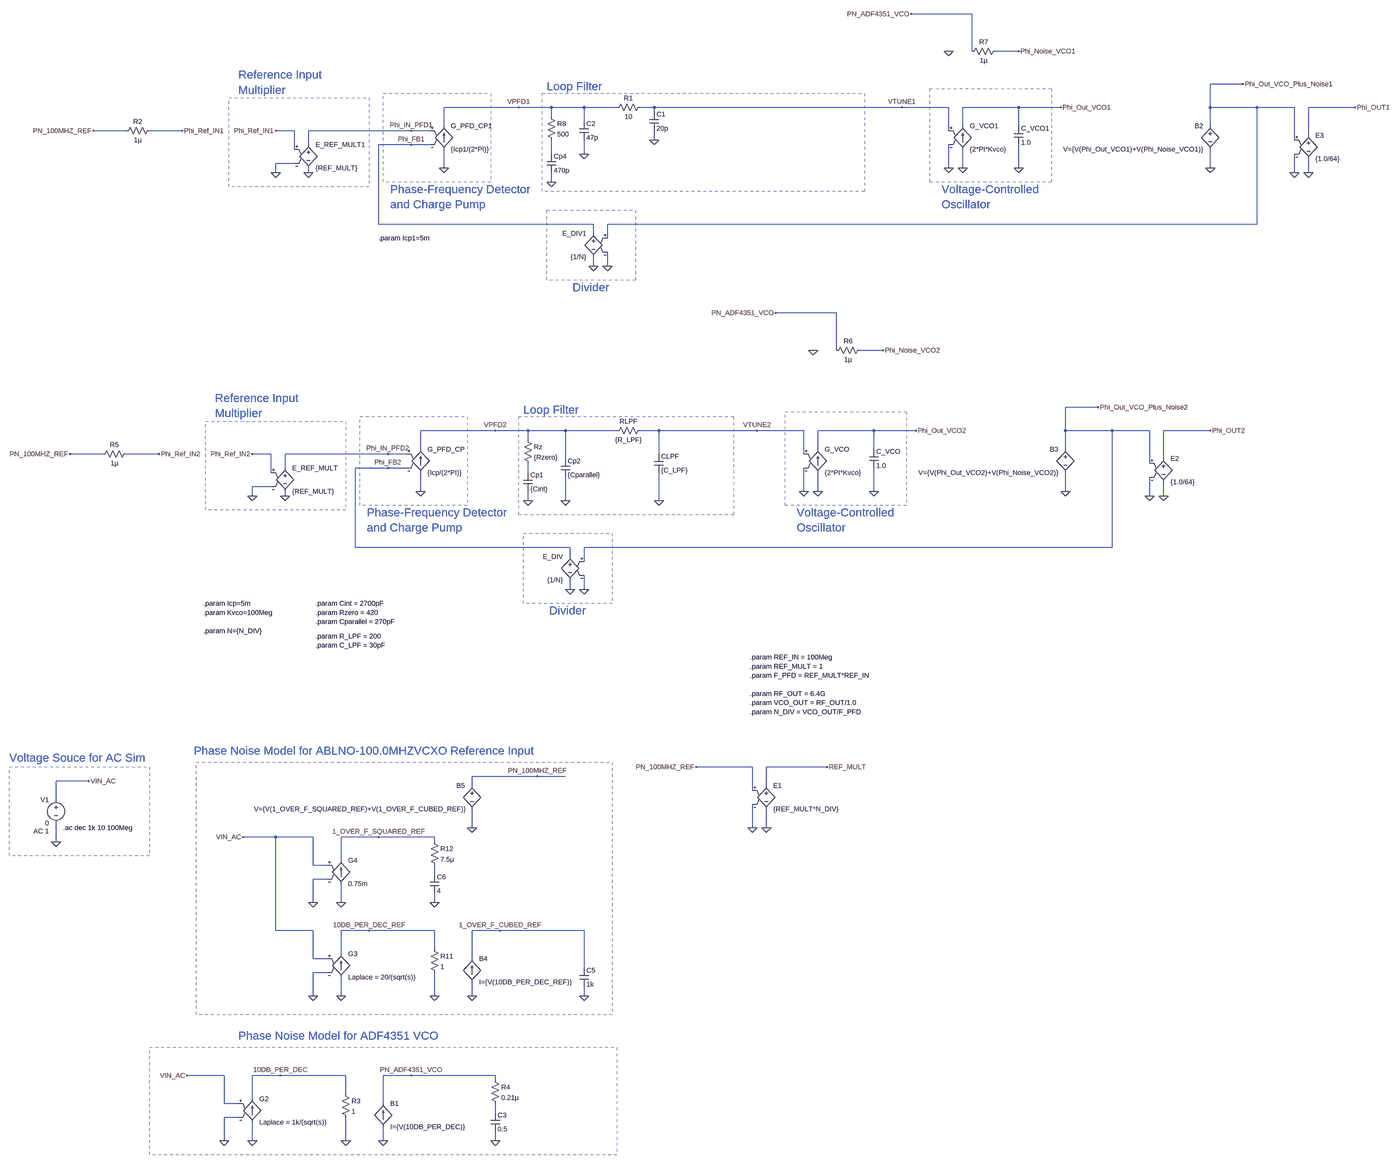
[diagram p0: schematic ADF4355_Freq_Synth_AC_Model.asc, whole sheet]
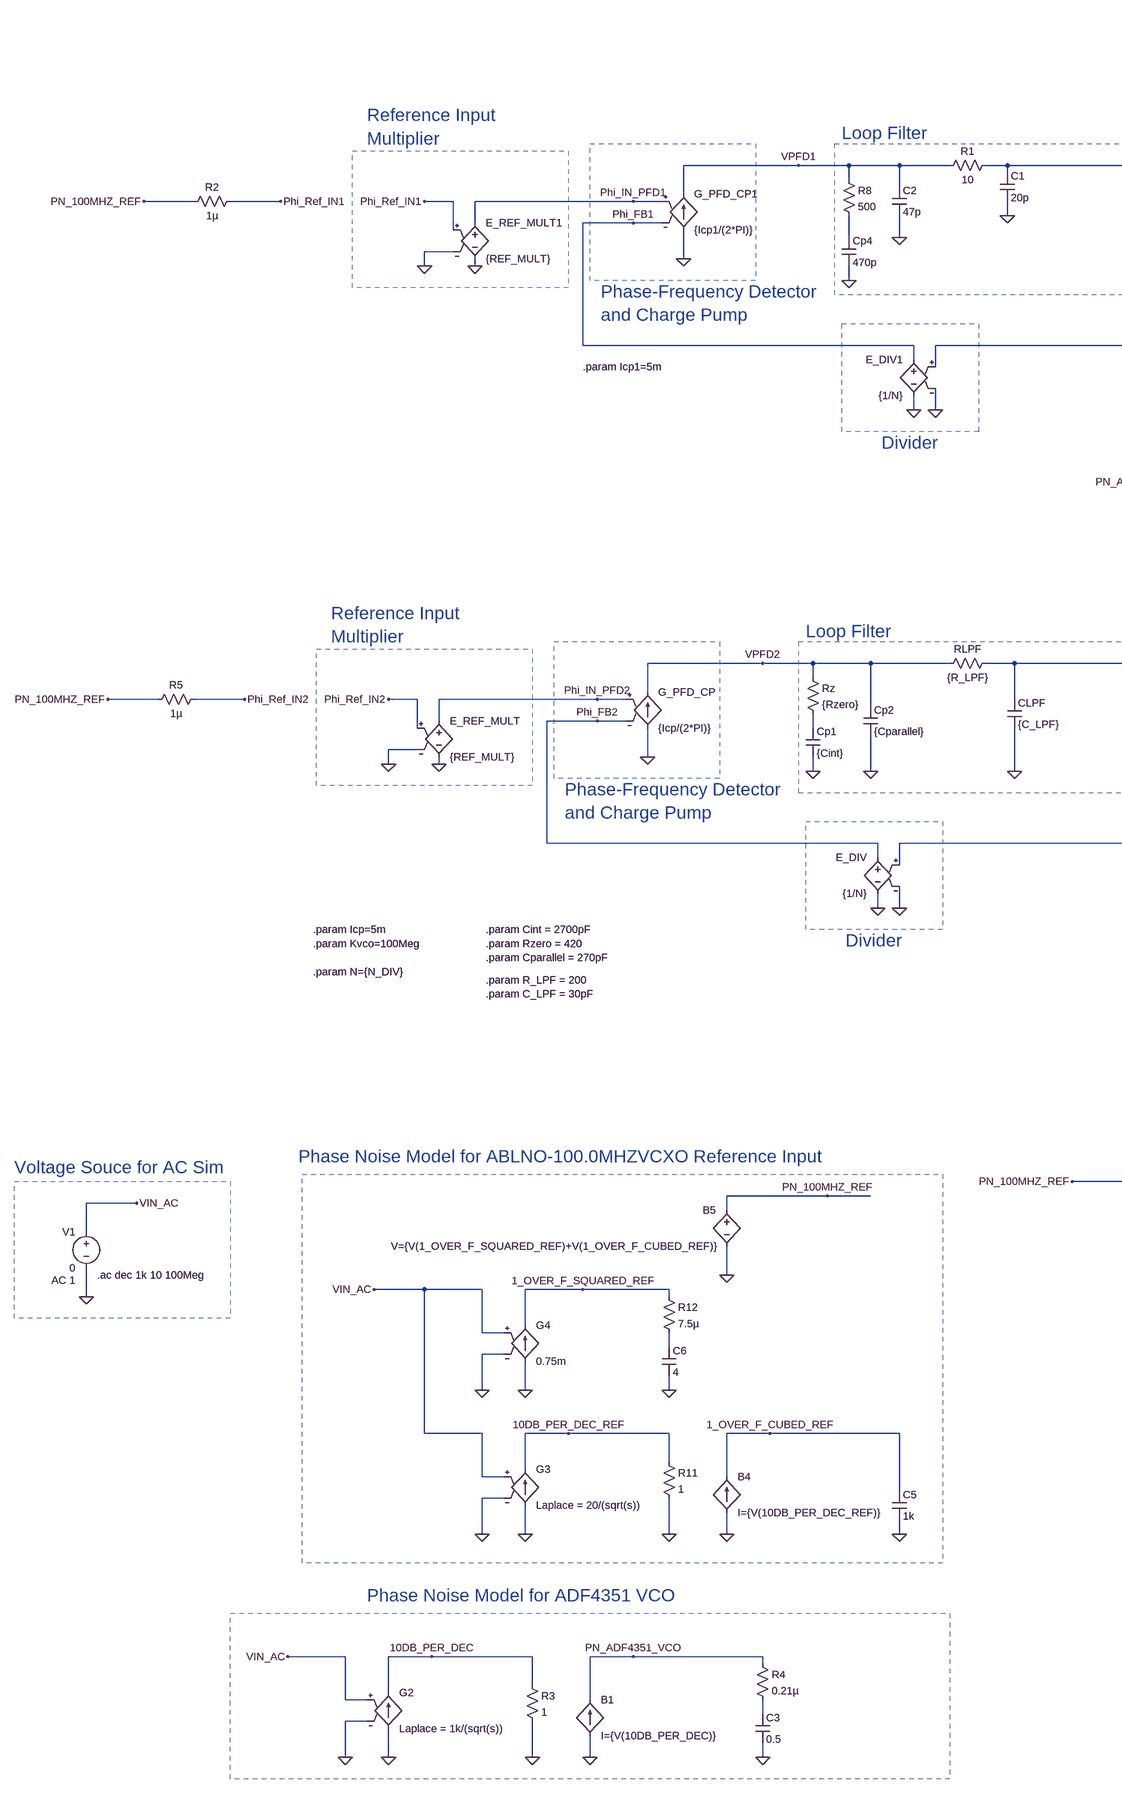
[diagram p1: schematic ADF4355_Freq_Synth_AC_Model.asc, part, row 1 of 1, column 1 of 2]
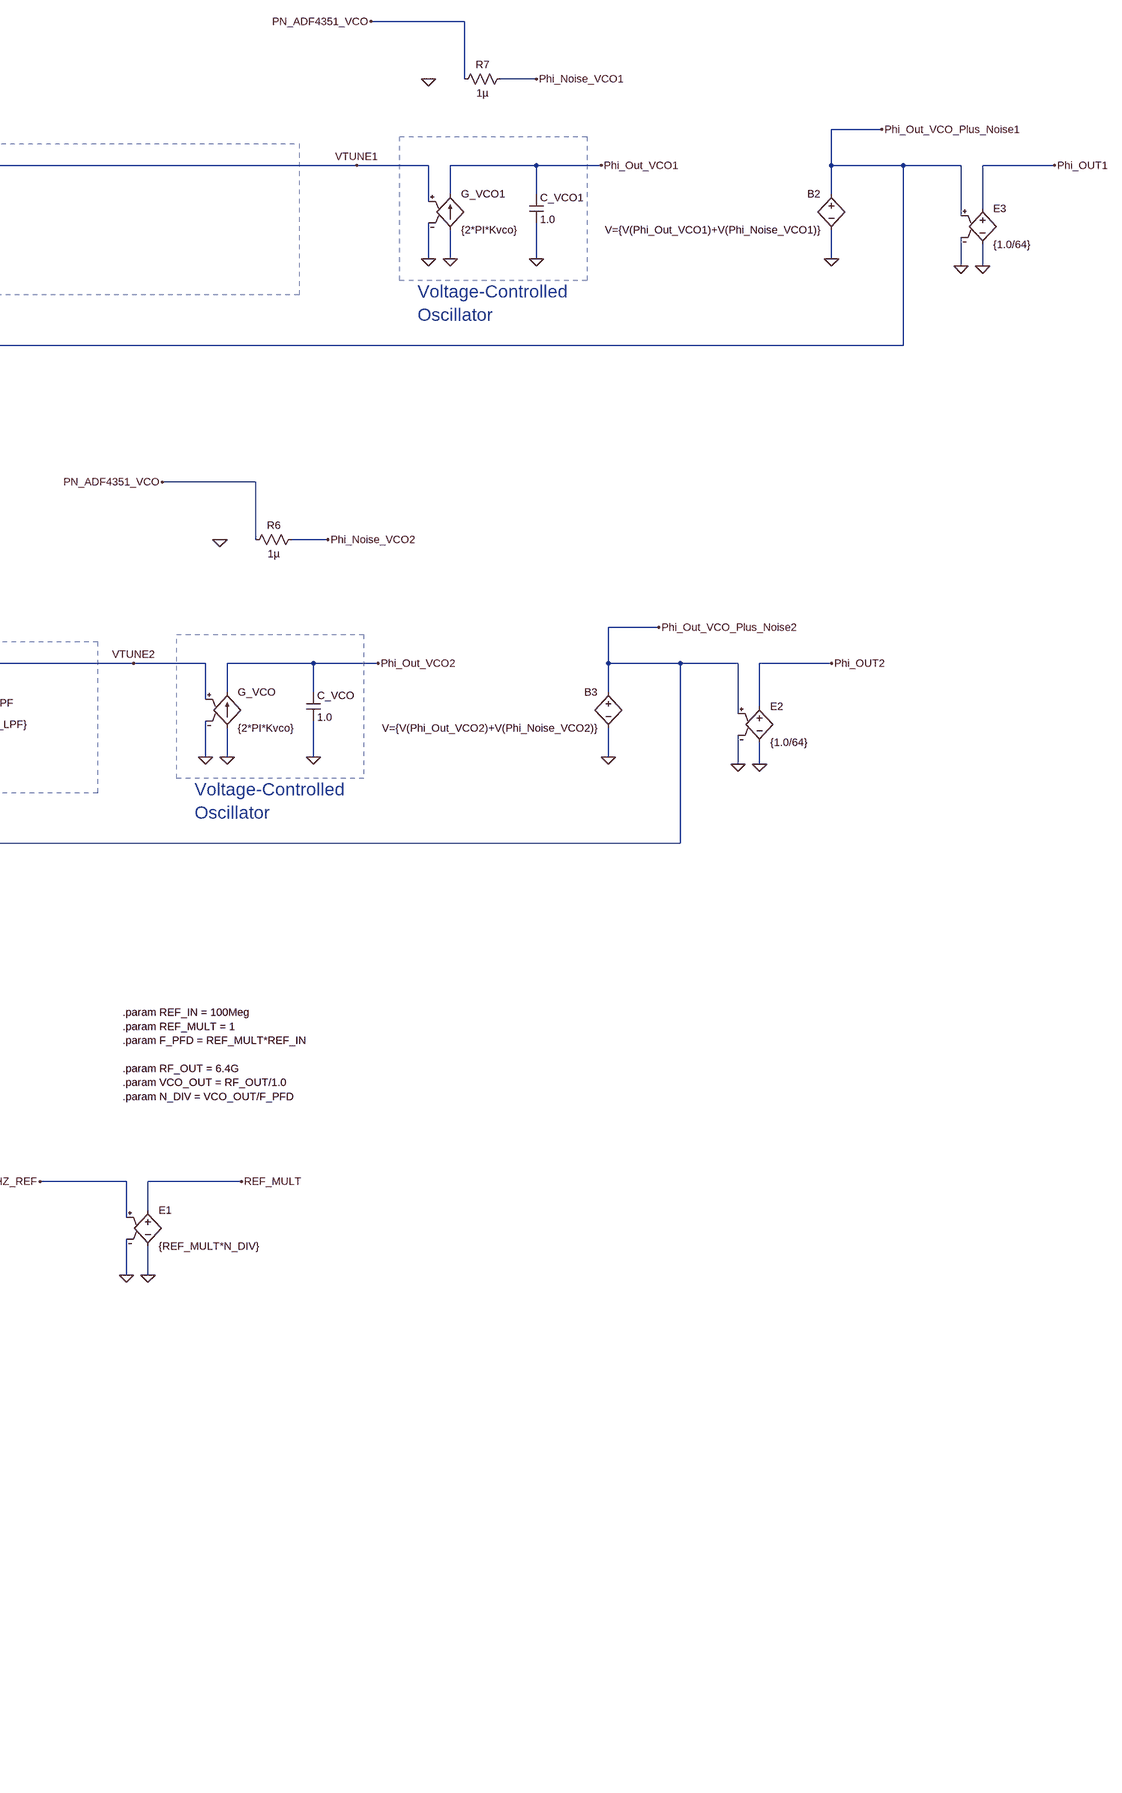
[diagram p2: schematic ADF4355_Freq_Synth_AC_Model.asc, part, row 1 of 1, column 2 of 2]
ADF4355_Freq_Synth_AC_Model.asc, the LTspice schematic file:
Version 4
SHEET 1 1844 2692
WIRE 400 -1344 192 -1344
WIRE 400 -1216 400 -1344
WIRE 560 -1216 480 -1216
WIRE 1328 -1104 1216 -1104
WIRE -1152 -1024 -1408 -1024
WIRE -1040 -1024 -1152 -1024
WIRE -928 -1024 -1040 -1024
WIRE -816 -1024 -928 -1024
WIRE -688 -1024 -736 -1024
WIRE 160 -1024 -688 -1024
WIRE 320 -1024 160 -1024
WIRE 560 -1024 368 -1024
WIRE 704 -1024 560 -1024
WIRE 1216 -1024 1216 -1104
WIRE 1376 -1024 1216 -1024
WIRE 1504 -1024 1376 -1024
WIRE 1712 -1024 1552 -1024
WIRE -688 -1008 -688 -1024
WIRE -1040 -992 -1040 -1024
WIRE -928 -976 -928 -1024
WIRE -1408 -960 -1408 -1024
WIRE 368 -960 368 -1024
WIRE 560 -960 560 -1024
WIRE 1216 -960 1216 -1024
WIRE -2496 -944 -2608 -944
WIRE -2304 -944 -2416 -944
WIRE -1920 -944 -1984 -944
WIRE -1520 -944 -1872 -944
WIRE -1456 -944 -1520 -944
WIRE 320 -944 320 -1024
WIRE 1552 -928 1552 -1024
WIRE -688 -912 -688 -944
WIRE 1504 -912 1504 -1024
WIRE -1872 -896 -1872 -944
WIRE -1520 -896 -1632 -896
WIRE -1456 -896 -1520 -896
WIRE -1920 -880 -1920 -944
WIRE -1040 -864 -1040 -912
WIRE -928 -864 -928 -912
WIRE -1920 -832 -1984 -832
WIRE -1408 -816 -1408 -880
WIRE 320 -816 320 -896
WIRE 368 -816 368 -880
WIRE 560 -816 560 -896
WIRE 1216 -816 1216 -880
WIRE -1984 -800 -1984 -832
WIRE -1872 -800 -1872 -816
WIRE 1504 -800 1504 -864
WIRE 1552 -800 1552 -848
WIRE -1040 -768 -1040 -800
WIRE -1632 -624 -1632 -896
WIRE -896 -624 -1632 -624
WIRE 1376 -624 1376 -1024
WIRE 1376 -624 -848 -624
WIRE -896 -592 -896 -624
WIRE -848 -576 -848 -624
WIRE -896 -480 -896 -512
WIRE -848 -480 -848 -528
WIRE -64 -320 -272 -320
WIRE -64 -192 -64 -320
WIRE 96 -192 16 -192
WIRE 832 48 720 48
WIRE -1232 128 -1488 128
WIRE -1120 128 -1232 128
WIRE -992 128 -1120 128
WIRE -816 128 -992 128
WIRE -672 128 -736 128
WIRE -336 128 -672 128
WIRE -176 128 -336 128
WIRE 64 128 -128 128
WIRE 208 128 64 128
WIRE 720 128 720 48
WIRE 880 128 720 128
WIRE 1008 128 880 128
WIRE 1216 128 1056 128
WIRE -1120 160 -1120 128
WIRE -1488 192 -1488 128
WIRE -128 192 -128 128
WIRE 64 192 64 128
WIRE 720 192 720 128
WIRE -2576 208 -2688 208
WIRE -2384 208 -2496 208
WIRE -2000 208 -2064 208
WIRE -1600 208 -1952 208
WIRE -1536 208 -1600 208
WIRE -672 208 -672 128
WIRE -176 208 -176 128
WIRE -992 224 -992 128
WIRE 1056 224 1056 128
WIRE 1008 240 1008 128
WIRE -1952 256 -1952 208
WIRE -1600 256 -1712 256
WIRE -1536 256 -1600 256
WIRE -2000 272 -2000 208
WIRE -1120 272 -1120 240
WIRE -2000 320 -2064 320
WIRE -1488 336 -1488 272
WIRE -176 336 -176 256
WIRE -128 336 -128 272
WIRE 64 336 64 256
WIRE 720 336 720 272
WIRE -2064 352 -2064 320
WIRE -1952 352 -1952 336
WIRE 1008 352 1008 288
WIRE 1056 352 1056 304
WIRE -1120 368 -1120 336
WIRE -992 368 -992 288
WIRE -672 368 -672 272
WIRE -1712 528 -1712 256
WIRE -976 528 -1712 528
WIRE 880 528 880 128
WIRE 880 528 -928 528
WIRE -976 560 -976 528
WIRE -928 576 -928 528
WIRE -976 672 -976 640
WIRE -928 672 -928 624
WIRE -352 1360 -544 1360
WIRE -96 1360 -304 1360
WIRE -1088 1392 -1312 1392
WIRE -992 1392 -1088 1392
WIRE -2624 1408 -2736 1408
WIRE -1312 1424 -1312 1392
WIRE -304 1424 -304 1360
WIRE -352 1440 -352 1360
WIRE -2736 1472 -2736 1408
WIRE -1312 1568 -1312 1504
WIRE -352 1568 -352 1488
WIRE -304 1568 -304 1504
WIRE -1984 1600 -2096 1600
WIRE -1856 1600 -1984 1600
WIRE -1632 1600 -1760 1600
WIRE -1440 1600 -1632 1600
WIRE -2736 1616 -2736 1552
WIRE -1440 1616 -1440 1600
WIRE -1760 1680 -1760 1600
WIRE -1856 1696 -1856 1600
WIRE -1808 1696 -1856 1696
WIRE -1440 1728 -1440 1696
WIRE -1808 1744 -1856 1744
WIRE -1856 1824 -1856 1744
WIRE -1760 1824 -1760 1760
WIRE -1440 1824 -1440 1792
WIRE -1984 1920 -1984 1600
WIRE -1856 1920 -1984 1920
WIRE -1664 1920 -1760 1920
WIRE -1440 1920 -1664 1920
WIRE -1216 1920 -1312 1920
WIRE -928 1920 -1216 1920
WIRE -1440 1984 -1440 1920
WIRE -1760 2000 -1760 1920
WIRE -1856 2016 -1856 1920
WIRE -1808 2016 -1856 2016
WIRE -1312 2016 -1312 1920
WIRE -928 2048 -928 1920
WIRE -1808 2064 -1856 2064
WIRE -1856 2144 -1856 2064
WIRE -1760 2144 -1760 2080
WIRE -1440 2144 -1440 2064
WIRE -1312 2144 -1312 2096
WIRE -928 2144 -928 2112
WIRE -2160 2416 -2288 2416
WIRE -1968 2416 -2064 2416
WIRE -1744 2416 -1968 2416
WIRE -1520 2416 -1616 2416
WIRE -1232 2416 -1520 2416
WIRE -1232 2432 -1232 2416
WIRE -1744 2480 -1744 2416
WIRE -2064 2496 -2064 2416
WIRE -2160 2512 -2160 2416
WIRE -2112 2512 -2160 2512
WIRE -1616 2512 -1616 2416
WIRE -1232 2544 -1232 2512
WIRE -2112 2560 -2160 2560
WIRE -2160 2640 -2160 2560
WIRE -2064 2640 -2064 2576
WIRE -1744 2640 -1744 2560
WIRE -1616 2640 -1616 2592
WIRE -1232 2640 -1232 2608
FLAG -992 368 0
FLAG -1488 336 0
FLAG 64 336 0
FLAG -128 336 0
FLAG -176 336 0
FLAG 1216 128 Phi_OUT2
FLAG -928 672 0
FLAG -976 672 0
FLAG -1600 256 Phi_FB2
FLAG -1600 208 Phi_IN_PFD2
FLAG -2736 1616 0
FLAG -1120 368 0
FLAG -336 128 VTUNE2
FLAG 208 128 Phi_Out_VCO2
FLAG 96 -192 Phi_Noise_VCO2
FLAG 720 336 0
FLAG -1952 352 0
FLAG -2384 208 Phi_Ref_IN2
FLAG -2064 352 0
FLAG -2064 208 Phi_Ref_IN2
FLAG -672 368 0
FLAG -1232 128 VPFD2
FLAG -2064 2640 0
FLAG -2160 2640 0
FLAG -1744 2640 0
FLAG -2288 2416 VIN_AC
FLAG -1968 2416 10DB_PER_DEC
FLAG -1616 2640 0
FLAG -1232 2640 0
FLAG -1520 2416 PN_ADF4351_VCO
FLAG -2624 1408 VIN_AC
FLAG -272 -320 PN_ADF4351_VCO
FLAG -144 -192 0
FLAG -2688 208 PN_100MHZ_REF
FLAG -304 1568 0
FLAG -352 1568 0
FLAG -96 1360 REF_MULT
FLAG -544 1360 PN_100MHZ_REF
FLAG 1056 352 0
FLAG 1008 352 0
FLAG 832 48 Phi_Out_VCO_Plus_Noise2
FLAG -1408 -816 0
FLAG 560 -816 0
FLAG 368 -816 0
FLAG 320 -816 0
FLAG 1712 -1024 Phi_OUT1
FLAG -848 -480 0
FLAG -896 -480 0
FLAG -1520 -896 Phi_FB1
FLAG -1520 -944 Phi_IN_PFD1
FLAG -1040 -768 0
FLAG 160 -1024 VTUNE1
FLAG 704 -1024 Phi_Out_VCO1
FLAG 1216 -816 0
FLAG -1872 -800 0
FLAG -2304 -944 Phi_Ref_IN1
FLAG -1984 -800 0
FLAG -1984 -944 Phi_Ref_IN1
FLAG -1152 -1024 VPFD1
FLAG -2608 -944 PN_100MHZ_REF
FLAG 1552 -800 0
FLAG 1504 -800 0
FLAG 1328 -1104 Phi_Out_VCO_Plus_Noise1
FLAG 560 -1216 Phi_Noise_VCO1
FLAG 192 -1344 PN_ADF4351_VCO
FLAG 320 -1216 0
FLAG -928 -864 0
FLAG -1760 2144 0
FLAG -1856 2144 0
FLAG -1440 2144 0
FLAG -1664 1920 10DB_PER_DEC_REF
FLAG -1312 2144 0
FLAG -928 2144 0
FLAG -1216 1920 1_OVER_F_CUBED_REF
FLAG -1760 1824 0
FLAG -1856 1824 0
FLAG -1440 1824 0
FLAG -1632 1600 1_OVER_F_SQUARED_REF
FLAG -1312 1568 0
FLAG -2096 1600 VIN_AC
FLAG -1088 1392 PN_100MHZ_REF
FLAG -688 -912 0
DATAFLAG 800 128 ""
DATAFLAG 800 128 ""
DATAFLAG 464 528 ""
DATAFLAG 464 528 ""
DATAFLAG -1808 208 ""
DATAFLAG -1808 208 ""
DATAFLAG -2480 208 ""
SYMBOL g -1488 176 R0
SYMATTR InstName G_PFD_CP
SYMATTR Value {Icp/(2*PI)}
SYMBOL cap -1008 224 R0
SYMATTR InstName Cp2
SYMATTR Value {Cparallel}
SYMBOL cap 48 192 R0
SYMATTR InstName C_VCO
SYMATTR Value 1.0
SYMBOL g -128 176 R0
SYMATTR InstName G_VCO
SYMATTR Value {2*PI*Kvco}
SYMBOL e -976 544 M0
SYMATTR InstName E_DIV
SYMATTR Value {1/N}
SYMBOL voltage -2736 1456 M0
WINDOW 123 24 124 Left 2
WINDOW 39 0 0 Left 2
SYMATTR Value2 AC 1
SYMATTR InstName V1
SYMATTR Value 0
SYMBOL cap -1136 272 R0
SYMATTR InstName Cp1
SYMATTR Value {Cint}
SYMBOL res -1136 144 R0
SYMATTR InstName Rz
SYMATTR Value {Rzero}
SYMBOL bv 720 176 M0
SYMATTR InstName B3
SYMATTR Value V={V(Phi_Out_VCO2)+V(Phi_Noise_VCO2)}
SYMBOL e -1952 240 R0
SYMATTR InstName E_REF_MULT
SYMATTR Value {REF_MULT}
SYMBOL res -720 112 R90
WINDOW 0 0 56 VBottom 2
WINDOW 3 32 56 VTop 2
SYMATTR InstName RLPF
SYMATTR Value {R_LPF}
SYMBOL cap -688 208 R0
SYMATTR InstName CLPF
SYMATTR Value {C_LPF}
SYMBOL g -2064 2480 R0
SYMATTR InstName G2
SYMATTR Value Laplace = 1k/(sqrt(s))
SYMBOL res -1760 2464 R0
SYMATTR InstName R3
SYMATTR Value 1
SYMBOL bi -1616 2592 M180
WINDOW 0 24 80 Left 2
WINDOW 3 24 0 Left 2
SYMATTR InstName B1
SYMATTR Value I={V(10DB_PER_DEC)}
SYMBOL cap -1248 2544 R0
SYMATTR InstName C3
SYMATTR Value 0.5
SYMBOL res -1248 2416 R0
SYMATTR InstName R4
SYMATTR Value 0.21µ
SYMBOL res -2480 192 R90
WINDOW 0 0 56 VBottom 2
WINDOW 3 32 56 VTop 2
SYMATTR InstName R5
SYMATTR Value 1µ
SYMBOL res 32 -208 R90
WINDOW 0 0 56 VBottom 2
WINDOW 3 32 56 VTop 2
SYMATTR InstName R6
SYMATTR Value 1µ
SYMBOL e -304 1408 R0
SYMATTR InstName E1
SYMATTR Value {REF_MULT*N_DIV}
SYMBOL e 1056 208 R0
SYMATTR InstName E2
SYMATTR Value {1.0/64}
SYMBOL g -1408 -976 R0
SYMATTR InstName G_PFD_CP1
SYMATTR Value {Icp1/(2*PI)}
SYMBOL cap 544 -960 R0
SYMATTR InstName C_VCO1
SYMATTR Value 1.0
SYMBOL g 368 -976 R0
SYMATTR InstName G_VCO1
SYMATTR Value {2*PI*Kvco}
SYMBOL e -896 -608 M0
SYMATTR InstName E_DIV1
SYMATTR Value {1/N}
SYMBOL cap -1056 -864 R0
SYMATTR InstName Cp4
SYMATTR Value 470p
SYMBOL bv 1216 -976 M0
SYMATTR InstName B2
SYMATTR Value V={V(Phi_Out_VCO1)+V(Phi_Noise_VCO1)}
SYMBOL e -1872 -912 R0
SYMATTR InstName E_REF_MULT1
SYMATTR Value {REF_MULT}
SYMBOL res -2400 -960 R90
WINDOW 0 0 56 VBottom 2
WINDOW 3 32 56 VTop 2
SYMATTR InstName R2
SYMATTR Value 1µ
SYMBOL e 1552 -944 R0
SYMATTR InstName E3
SYMATTR Value {1.0/64}
SYMBOL res 496 -1232 R90
WINDOW 0 0 56 VBottom 2
WINDOW 3 32 56 VTop 2
SYMATTR InstName R7
SYMATTR Value 1µ
SYMBOL res -1056 -1008 R0
SYMATTR InstName R8
SYMATTR Value 500
SYMBOL cap -944 -976 R0
SYMATTR InstName C2
SYMATTR Value 47p
SYMBOL g -1760 1984 R0
SYMATTR InstName G3
SYMATTR Value Laplace = 20/(sqrt(s))
SYMBOL res -1456 1968 R0
SYMATTR InstName R11
SYMATTR Value 1
SYMBOL bi -1312 2096 M180
WINDOW 0 24 80 Left 2
WINDOW 3 24 0 Left 2
SYMATTR InstName B4
SYMATTR Value I={V(10DB_PER_DEC_REF)}
SYMBOL cap -944 2048 R0
SYMATTR InstName C5
SYMATTR Value 1k
SYMBOL g -1760 1664 R0
SYMATTR InstName G4
SYMATTR Value 0.75m
SYMBOL cap -1456 1728 R0
SYMATTR InstName C6
SYMATTR Value 4
SYMBOL res -1456 1600 R0
SYMATTR InstName R12
SYMATTR Value 7.5µ
SYMBOL bv -1312 1408 M0
SYMATTR InstName B5
SYMATTR Value V={V(1_OVER_F_SQUARED_REF)+V(1_OVER_F_CUBED_REF)}
SYMBOL res -720 -1040 R90
WINDOW 0 0 56 VBottom 2
WINDOW 3 32 56 VTop 2
SYMATTR InstName R1
SYMATTR Value 10
SYMBOL cap -704 -1008 R0
SYMATTR InstName C1
SYMATTR Value 20p
TEXT -2232 720 Left 2 !.param Icp=5m\n.param Kvco=100Meg\n \n.param N={N_DIV}
TEXT -1136 56 Left 4 ;Loop Filter
TEXT -1672 408 Left 4 ;Phase-Frequency Detector\nand Charge Pump
TEXT -200 408 Left 4 ;Voltage-Controlled\nOscillator
TEXT -1048 744 Left 4 ;Divider
TEXT -1848 720 Left 2 !.param Cint = 2700pF\n.param Rzero = 420\n.param Cparallel = 270pF
TEXT -360 904 Left 2 !.param REF_IN = 100Meg\n.param REF_MULT = 1\n.param F_PFD = REF_MULT*REF_IN\n \n.param RF_OUT = 6.4G\n.param VCO_OUT = RF_OUT/1.0\n.param N_DIV = VCO_OUT/F_PFD
TEXT -2192 16 Left 4 ;Reference Input\nMultiplier
TEXT -1848 832 Left 2 !.param R_LPF = 200\n.param C_LPF = 30pF
TEXT -2112 2280 Left 4 ;Phase Noise Model for ADF4351 VCO
TEXT -2264 1304 Left 4 ;Phase Noise Model for ABLNO-100.0MHZVCXO Reference Input
TEXT -2896 1328 Left 4 ;Voltage Souce for AC Sim
TEXT -2712 1568 Left 2 !.ac dec 1k 10 100Meg
TEXT -1056 -1096 Left 4 ;Loop Filter
TEXT -1592 -744 Left 4 ;Phase-Frequency Detector\nand Charge Pump
TEXT 296 -744 Left 4 ;Voltage-Controlled\nOscillator
TEXT -968 -408 Left 4 ;Divider
TEXT -2112 -1136 Left 4 ;Reference Input\nMultiplier
TEXT -1632 -576 Left 2 !.param Icp1=5m
RECTANGLE Normal -1328 384 -1696 80 2
RECTANGLE Normal -416 416 -1152 80 2
RECTANGLE Normal 176 384 -240 64 2
RECTANGLE Normal -832 720 -1136 480 2
RECTANGLE Normal -1744 400 -2224 96 2
RECTANGLE Normal -816 2688 -2416 2320 2
RECTANGLE Normal -832 2208 -2256 1344 2
RECTANGLE Normal -2416 1664 -2896 1360 2
RECTANGLE Normal -1248 -768 -1616 -1072 2
RECTANGLE Normal 32 -736 -1072 -1072 2
RECTANGLE Normal 672 -768 256 -1088 2
RECTANGLE Normal -752 -432 -1056 -672 2
RECTANGLE Normal -1664 -752 -2144 -1056 2

The netlist it stands for:
* ADF4355_Freq_Synth_AC_Model.asc
G_PFD_CP 0 VPFD2 Phi_IN_PFD2 Phi_FB2 {Icp/(2*PI)}
Cp2 VPFD2 0 {Cparallel}
C_VCO Phi_Out_VCO2 0 1.0
G_VCO 0 Phi_Out_VCO2 VTUNE2 0 {2*PI*Kvco}
E_DIV Phi_FB2 0 Phi_Out_VCO_Plus_Noise2 0 {1/N}
V1 VIN_AC 0 0 AC 1
Cp1 N002 0 {Cint}
Rz VPFD2 N002 {Rzero}
B3 Phi_Out_VCO_Plus_Noise2 0 V={V(Phi_Out_VCO2)+V(Phi_Noise_VCO2)}
E_REF_MULT Phi_IN_PFD2 0 Phi_Ref_IN2 0 {REF_MULT}
RLPF VTUNE2 VPFD2 {R_LPF}
CLPF VTUNE2 0 {C_LPF}
G2 0 10DB_PER_DEC VIN_AC 0 Laplace = 1k/(sqrt(s))
R3 10DB_PER_DEC 0 1
B1 0 PN_ADF4351_VCO I={V(10DB_PER_DEC)}
C3 N004 0 0.5
R4 PN_ADF4351_VCO N004 0.21µ
R5 Phi_Ref_IN2 PN_100MHZ_REF 1µ
R6 Phi_Noise_VCO2 PN_ADF4351_VCO 1µ
E1 REF_MULT 0 PN_100MHZ_REF 0 {REF_MULT*N_DIV}
E2 Phi_OUT2 0 Phi_Out_VCO_Plus_Noise2 0 {1.0/64}
G_PFD_CP1 0 VPFD1 Phi_IN_PFD1 Phi_FB1 {Icp1/(2*PI)}
C_VCO1 Phi_Out_VCO1 0 1.0
G_VCO1 0 Phi_Out_VCO1 VTUNE1 0 {2*PI*Kvco}
E_DIV1 Phi_FB1 0 Phi_Out_VCO_Plus_Noise1 0 {1/N}
Cp4 N001 0 470p
B2 Phi_Out_VCO_Plus_Noise1 0 V={V(Phi_Out_VCO1)+V(Phi_Noise_VCO1)}
E_REF_MULT1 Phi_IN_PFD1 0 Phi_Ref_IN1 0 {REF_MULT}
R2 Phi_Ref_IN1 PN_100MHZ_REF 1µ
E3 Phi_OUT1 0 Phi_Out_VCO_Plus_Noise1 0 {1.0/64}
R7 Phi_Noise_VCO1 PN_ADF4351_VCO 1µ
R8 VPFD1 N001 500
C2 VPFD1 0 47p
G3 0 10DB_PER_DEC_REF VIN_AC 0 Laplace = 20/(sqrt(s))
R11 10DB_PER_DEC_REF 0 1
B4 0 1_OVER_F_CUBED_REF I={V(10DB_PER_DEC_REF)}
C5 1_OVER_F_CUBED_REF 0 1k
G4 0 1_OVER_F_SQUARED_REF VIN_AC 0 0.75m
C6 N003 0 4
R12 1_OVER_F_SQUARED_REF N003 7.5µ
B5 PN_100MHZ_REF 0 V={V(1_OVER_F_SQUARED_REF)+V(1_OVER_F_CUBED_REF)}
R1 VTUNE1 VPFD1 10
C1 VTUNE1 0 20p
.param Icp=5m
.param Kvco=100Meg
.param N={N_DIV}
* Loop Filter
* Phase-Frequency Detector
* and Charge Pump
* Voltage-Controlled
* Oscillator
* Divider
.param Cint = 2700pF
.param Rzero = 420
.param Cparallel = 270pF
.param REF_IN = 100Meg
.param REF_MULT = 1
.param F_PFD = REF_MULT*REF_IN
.param RF_OUT = 6.4G
.param VCO_OUT = RF_OUT/1.0
.param N_DIV = VCO_OUT/F_PFD
* Reference Input
* Multiplier
.param R_LPF = 200
.param C_LPF = 30pF
* Phase Noise Model for ADF4351 VCO
* Phase Noise Model for ABLNO-100.0MHZVCXO Reference Input
* Voltage Souce for AC Sim
.ac dec 1k 10 100Meg
* Loop Filter
* Phase-Frequency Detector
* and Charge Pump
* Voltage-Controlled
* Oscillator
* Divider
* Reference Input
* Multiplier
.param Icp1=5m
.backanno
.end